# Altium project M-BOX.PrjPcb
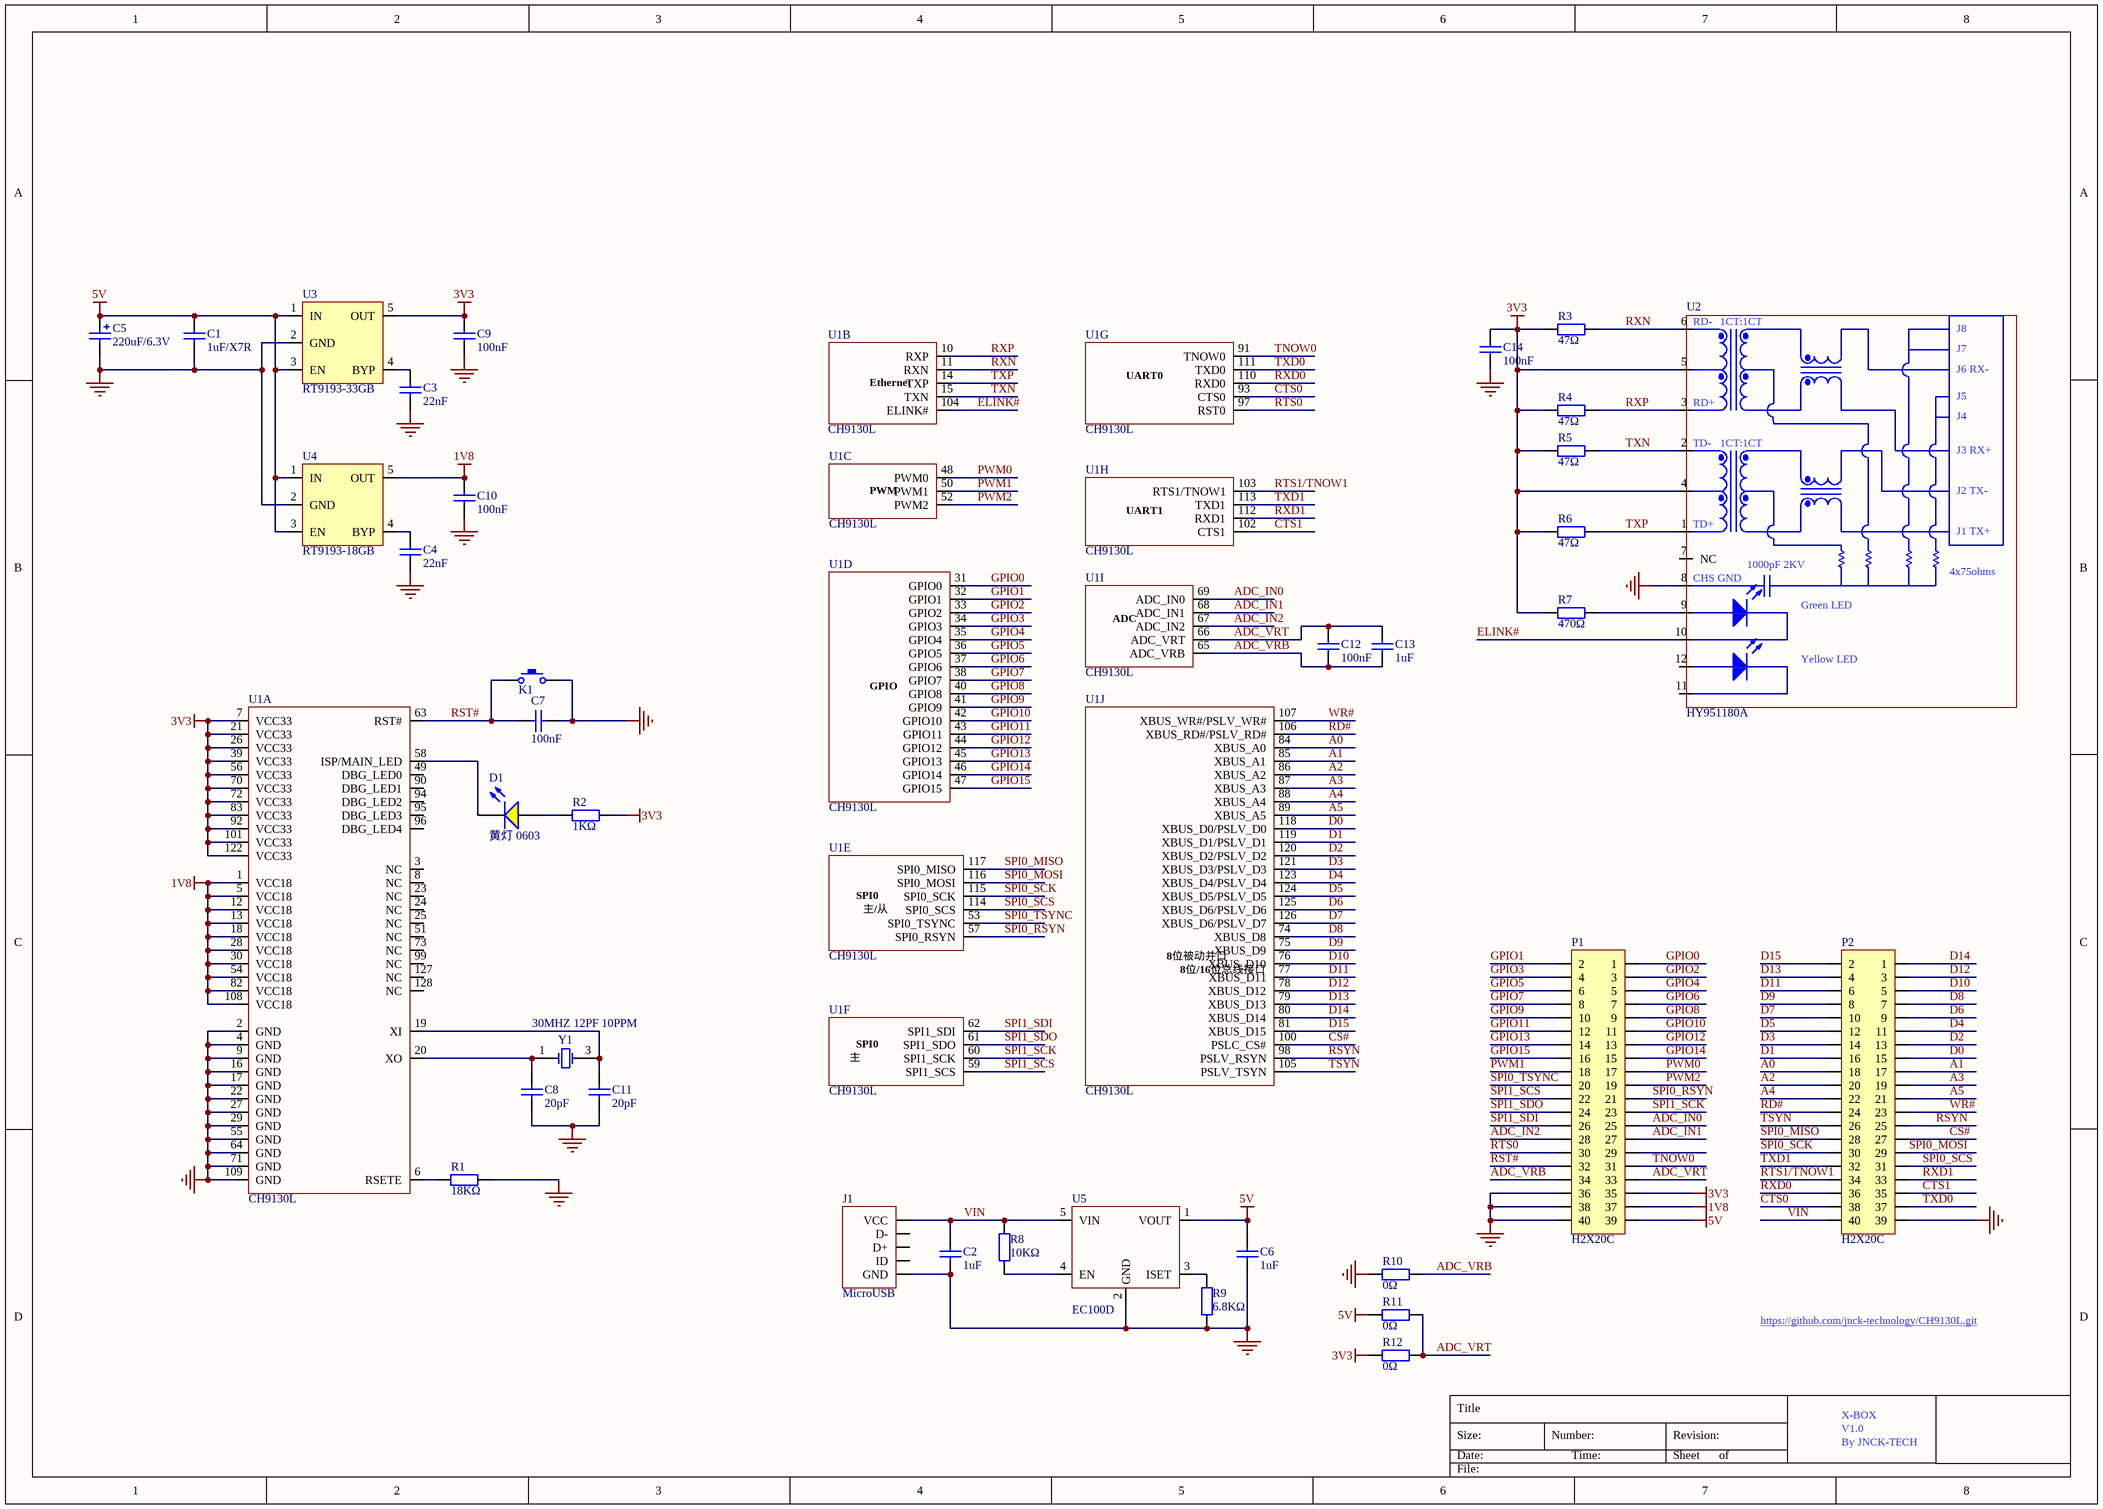
[diagram p0: M-BOX.SchDoc]
1 sheet, 37 parts. Net scope: global (net labels, ports and power ports of the same name join across sheets).
Board file: M-BOX.PcbDoc

## Sheet M-BOX.SchDoc
size A3; Organization: 无锡必创; Address1: 江苏省无锡市; Address2: 南长区; Address3: 飞宏路58号; Revision: V1.0; SheetNumber: G0909A01; ProjectName: 温湿度气压万年历

### Parts
C1  1uF/X7R  [LC-0603_C]
C2  1uF  [LC-0603_C]
C3  22nF  [LC-0603_C]
C4  22nF  [LC-0603_C]
C5  220uF/6.3V  [LC-CASE-A_3216]
C6  1uF  [LC-0603_C]
C7  100nF  [LC-0603_C]
C8  20pF  [LC-0603_C]
C9  100nF  [LC-0603_C]
C10  100nF  [LC-0603_C]
C11  20pF  [LC-0603_C]
C12  100nF  [LC-0603_C]
C13  1uF  [LC-0603_C]
C14  100nF  [LC-0603_C]
D1  黄灯 0603  [LC-0603_LED_S1]
J1  MicroUSB  [MicroUSB]
K1  TS-1107U  [TS-1107U]  (value not drawn)
P1  H2X20C  [H2X20C]
P2  H2X20C  [H2X20C]
R1  18KΩ  [LC-0603_R]
R2  1KΩ  [LC-0603_R]
R3  47Ω  [LC-0603_R]
R4  47Ω  [LC-0603_R]
R5  47Ω  [LC-0603_R]
R6  47Ω  [LC-0603_R]
R7  470Ω  [LC-0603_R]
R8  10KΩ  [LC-0603_R]
R9  6.8KΩ  [LC-0603_R]
R10  0Ω  [LC-0603_R]
R11  0Ω  [LC-0603_R]
R12  0Ω  [LC-0603_R]
U1  CH9130L  [LC-LQFP-128_14x14x04P]  (parts A,B,C,D,E,F,G,H,I,J of 10)
U2  HY951180A  [HY951180A]
U3  RT9193-33GB  [LC-SOT-23-5]
U4  RT9193-18GB  [LC-SOT-23-5]
U5  EC100D  [LC-SOT-23-5]
Y1  30MHZ 12PF 10PPM  [LC-SMD-3225_4P]

### Nets
1V8: C10.2 P1.37 U1.1(VCC18) U1.5(VCC18) U1.12(VCC18) U1.13(VCC18) U1.18(VCC18) U1.28(VCC18) U1.30(VCC18) U1.54(VCC18) U1.82(VCC18) U1.108(VCC18) U4.5(OUT)
3V3: C9.2 C14.2 P1.35 R2.2 R3.1 R4.1 R5.1 R6.1 R7.1 R12.1 U1.7(VCC33) U1.21(VCC33) U1.26(VCC33) U1.39(VCC33) U1.56(VCC33) U1.70(VCC33) U1.72(VCC33) U1.83(VCC33) U1.92(VCC33) U1.101(VCC33) U1.122(VCC33) U2.4 U2.5 U3.5(OUT)
5V: C1.2 C5.1 C6.2 P1.39 R11.1 U3.1(IN) U3.3(EN) U4.1(IN) U4.3(EN) U5.1(VOUT)
GND: C1.1 C2.1 C3.1 C4.1 C5.2 C6.1 C7.1 C8.1 C9.1 C10.1 C11.1 C14.1 J1.5(GND) K1.2 P1.36 P1.38 P1.40 P2.39 R1.2 R9.1 R10.1 U1.2(GND) U1.4(GND) U1.9(GND) U1.16(GND) U1.17(GND) U1.22(GND) U1.27(GND) U1.29(GND) U1.55(GND) U1.64(GND) U1.71(GND) U1.109(GND) U2.8(GND) U3.2(GND) U4.2(GND) U5.2(GND)
A0: P2.18 U1.84(XBUS_A0)
A1: P2.17 U1.85(XBUS_A1)
A2: P2.20 U1.86(XBUS_A2)
A3: P2.19 U1.87(XBUS_A3)
A4: P2.22 U1.88(XBUS_A4)
A5: P2.21 U1.89(XBUS_A5)
ADC_IN0: P1.25 U1.69(ADC_IN0)
ADC_IN1: P1.27 U1.68(ADC_IN1)
ADC_IN2: P1.28 U1.67(ADC_IN2)
ADC_VRB: C12.1 C13.1 P1.34 R10.2 U1.65(ADC_VRB)
ADC_VRT: C12.2 C13.2 P1.33 R11.2 R12.2 U1.66(ADC_VRT)
CS#: P2.27 U1.100(PSLC_CS#)
CTS0: P2.38 U1.93(CTS0)
CTS1: P2.35 U1.102(CTS1)
D0: P2.15 U1.118(XBUS_D0/PSLV_D0)
D1: P2.16 U1.119(XBUS_D1/PSLV_D1)
D2: P2.13 U1.120(XBUS_D2/PSLV_D2)
D3: P2.14 U1.121(XBUS_D3/PSLV_D3)
D4: P2.11 U1.123(XBUS_D4/PSLV_D4)
D5: P2.12 U1.124(XBUS_D5/PSLV_D5)
D6: P2.9 U1.125(XBUS_D6/PSLV_D6)
D7: P2.10 U1.126(XBUS_D6/PSLV_D7)
D8: P2.7 U1.74(XBUS_D8)
D9: P2.8 U1.75(XBUS_D9)
D10: P2.5 U1.76(XBUS_D10)
D11: P2.6 U1.77(XBUS_D11)
D12: P2.3 U1.78(XBUS_D12)
D13: P2.4 U1.79(XBUS_D13)
D14: P2.1 U1.80(XBUS_D14)
D15: P2.2 U1.81(XBUS_D15)
ELINK#: U1.104(ELINK#) U2.10
GPIO0: P1.1 U1.31(GPIO0)
GPIO1: P1.2 U1.32(GPIO1)
GPIO2: P1.3 U1.33(GPIO2)
GPIO3: P1.4 U1.34(GPIO3)
GPIO4: P1.5 U1.35(GPIO4)
GPIO5: P1.6 U1.36(GPIO5)
GPIO6: P1.7 U1.37(GPIO6)
GPIO7: P1.8 U1.38(GPIO7)
GPIO8: P1.9 U1.40(GPIO8)
GPIO9: P1.10 U1.41(GPIO9)
GPIO10: P1.11 U1.42(GPIO10)
GPIO11: P1.12 U1.43(GPIO11)
GPIO12: P1.13 U1.44(GPIO12)
GPIO13: P1.14 U1.45(GPIO13)
GPIO14: P1.15 U1.46(GPIO14)
GPIO15: P1.16 U1.47(GPIO15)
PWM0: P1.17 U1.48(PWM0)
PWM1: P1.18 U1.50(PWM1)
PWM2: P1.19 U1.52(PWM2)
RD#: P2.24 U1.106(XBUS_RD#/PSLV_RD#)
RST#: C7.2 K1.1 P1.32 U1.63(RST#)
RSYN: P2.25 U1.98(PSLV_RSYN)
RTS0: P1.30 U1.97(RST0)
RTS1/TNOW1: P2.34 U1.103(RTS1/TNOW1)
RXD0: P2.36 U1.110(RXD0)
RXD1: P2.33 U1.112(RXD1)
RXN: R3.2 U1.11(RXN) U2.6(RD-)
RXP: R4.2 U1.10(RXP) U2.3(RD+)
SPI0_MISO: P2.28 U1.117(SPI0_MISO)
SPI0_MOSI: P2.29 U1.116(SPI0_MOSI)
SPI0_RSYN: P1.21 U1.57(SPI0_RSYN)
SPI0_SCK: P2.30 U1.115(SPI0_SCK)
SPI0_SCS: P2.31 U1.114(SPI0_SCS)
SPI0_TSYNC: P1.20 U1.53(SPI0_TSYNC)
SPI1_SCK: P1.23 U1.60(SPI1_SCK)
SPI1_SCS: P1.22 U1.59(SPI1_SCS)
SPI1_SDI: P1.26 U1.62(SPI1_SDI)
SPI1_SDO: P1.24 U1.61(SPI1_SDO)
TNOW0: P1.31 U1.91(TNOW0)
TSYN: P2.26 U1.105(PSLV_TSYN)
TXD0: P2.37 U1.111(TXD0)
TXD1: P2.32 U1.113(TXD1)
TXN: R5.2 U1.15(TXN) U2.2(TD-)
TXP: R6.2 U1.14(TXP) U2.1(TD+)
VIN: C2.2 J1.1(VCC) P2.40 R8.2 U5.5(VIN)
WR#: P2.23 U1.107(XBUS_WR#/PSLV_WR#)
NetC3_2: C3.2 U3.4(BYP)
NetC4_2: C4.2 U4.4(BYP)
NetC8_2: C8.2 U1.20(XO) Y1.1(OSC1)
NetC11_2: C11.2 U1.19(XI) Y1.3(OSC2)
NetD1_A: D1.A R2.1
NetD1_K: D1.K U1.58(ISP/MAIN_LED)
NetR1_1: R1.1 U1.6(RSETE)
NetR7_2: R7.2 U2.9
NetR8_1: R8.1 U5.4(EN)
NetR9_2: R9.2 U5.3(ISET)

Not connected (* = marked no-connect by the designer): J1 2(D-) 3(D+) 4(ID); P1 29; U1 3(NC) 8(NC) 23(NC) 24(NC) 25(NC) 49(DBG_LED0) 51(NC) 73(NC) 90(DBG_LED1) 94(DBG_LED2) 95(DBG_LED3) 96(DBG_LED4) 99(NC) 127(NC) 128(NC); U2 7(NC) 11 12

### Notes on the sheet
- https://github.com/jnck-technology/CH9130L.git
- X-BOX
- V1.0
- By JNCK-TECH
- Title
- Size:
- Date:
- Number:
- Time:
- Revision:
- Sheet
- of
- File:
- (in symbol CH9130L, part B) Ethernet
- (in symbol CH9130L, part C) PWM
- (in symbol CH9130L, part D) GPIO
- (in symbol CH9130L, part E) SPI0; 主/从
- (in symbol CH9130L, part F) SPI0; 主
- (in symbol CH9130L, part G) UART0
- (in symbol CH9130L, part H) UART1
- (in symbol CH9130L, part I) ADC
- (in symbol CH9130L, part J) 8位被动并口; 8位/16位总线接口
- (in symbol HY951180A) 1CT:1CT; J8; J7; J6 RX-; J5; J4; J3 RX+; J2 TX-; J1 TX+; 1000pF 2KV; 4x75ohms; CHS GND; Green LED; Yellow LED

### Library data of the parts
C1 C2 C6 C13 = 0603 1uF (105) 10% 50V: 贴片电容; ComponentLink1Description: 供应商链接; Package: 0603; Supplier: LC
  C1: ComponentLink1URL: http://www.szlcsc.com/product/details_30690.html; SuppliersPartNumber: C29936
  C2 C6 C13: ComponentLink1URL: http://www.szlcsc.com/product/details_16531.html; SuppliersPartNumber: C15849
C3 C4 = 0603 22nF (223) 10% 50V: 贴片电容; ComponentLink1Description: 供应商链接; ComponentLink1URL: http://www.szlcsc.com/product/details_21834.html; Package: 0603; Supplier: LC; SuppliersPartNumber: C21122
C5 = 3216 10uF (106) 10% 16V: 钽电容; ComponentLink1Description: 供应商链接; ComponentLink1URL: http://www.szlcsc.com/product/details_28028.html; Package: 3216; Supplier: LC; SuppliersPartNumber: C27279
C7 C9 C10 C12 C14 = 0603 100nF (104) 10% 50V: 贴片电容; ComponentLink1Description: 供应商链接; ComponentLink1URL: http://www.szlcsc.com/product/details_15331.html; Package: 0603; Supplier: LC; SuppliersPartNumber: C14663
C8 C11 = 0603 20pF (200) 5% 50V: 贴片电容; ComponentLink1Description: 供应商链接; ComponentLink1URL: http://www.szlcsc.com/product/details_2000.html; Package: 0603; Supplier: LC; SuppliersPartNumber: C1648
D1 = 0603 黄灯: 发光二极管; ComponentLink1Description: 供应商链接; ComponentLink1URL: http://www.szlcsc.com/product/details_73147.html; Package: 0603; Supplier: LC; SuppliersPartNumber: C72038
K1 = SW_TS-1107U: 轻触按钮; Manufacturer: 皓宇電子; Manufacturer No: TS-1107U
P1 P2 = H2X20C: 排母/2.54mm 2*20P 长脚排座; ComponentLink1Description: 供应商链接; ComponentLink1URL: http://www.szlcsc.com/product/details_36136.html; Supplier: LC; SuppliersPartNumber: C35165
R1 = 0603 18KΩ (1802) 1%: 贴片电阻; ComponentLink1Description: 供应商链接; ComponentLink1URL: http://www.szlcsc.com/product/details_26553.html; Package: 0603; Supplier: LC; SuppliersPartNumber: C25810
R2 = 0603 1KΩ (1001) 1%: 贴片电阻; ComponentLink1Description: 供应商链接; ComponentLink1URL: http://www.szlcsc.com/product/details_21904.html; Package: 0603; Supplier: LC; SuppliersPartNumber: C21190
R3-R6 = 0603 47Ω (47R0) 1%: 贴片电阻; ComponentLink1Description: 供应商链接; ComponentLink1URL: http://www.szlcsc.com/product/details_23909.html; Package: 0603; Supplier: LC; SuppliersPartNumber: C23182
R7 = 0603 470Ω (4700) 1%: 贴片电阻; ComponentLink1Description: 供应商链接; ComponentLink1URL: http://www.szlcsc.com/product/details_23906.html; Package: 0603; Supplier: LC; SuppliersPartNumber: C23179
R8 = 0603 10KΩ (1002) 1%: 贴片电阻; ComponentLink1Description: 供应商链接; ComponentLink1URL: http://www.szlcsc.com/product/details_26547.html; Package: 0603; Supplier: LC; SuppliersPartNumber: C25804
R9 = 0603 6.8KΩ (6801) 1%: 贴片电阻; ComponentLink1Description: 供应商链接; ComponentLink1URL: http://www.szlcsc.com/product/details_23939.html; Package: 0603; Supplier: LC; SuppliersPartNumber: C23212
R10-R12 = 0603 0Ω (0R0) 1%: 贴片电阻; ComponentLink1Description: 供应商链接; ComponentLink1URL: http://www.szlcsc.com/product/details_21903.html; Package: 0603; Supplier: LC; SuppliersPartNumber: C21189
U1 = CH9130L: 以太网扩展多外设接口芯片; Manufacturer: WCH(南京沁恒); JLC No: C97380; Manufacturer No: CH9130L; Value: *
U2 = HY951180A: 网口; Manufacturer: HANRUN(汉仁); JLC No: C34677; Manufacturer No: HY951180A; Value: *
U3 = RT9193-33GB: RT9193 Series 300 mA 3.3 V; ComponentLink1Description: 供应商链接; ComponentLink1URL: http://www.szlcsc.com/product/details_16332.html; Package: SOT-23-5; Supplier: LC; SuppliersPartNumber: C15651
U4 = RT9193-18GB: RT9193 Series 1.8V 300 mA; ComponentLink1Description: 供应商链接; ComponentLink1URL: http://www.szlcsc.com/product/details_28165.html; Package: SOT-23-5; Supplier: LC; SuppliersPartNumber: C27416
U5 = EC100D: 短路、过流保护芯片; Manufacturer: FM富满; ComponentLink1Description: 供应商链接; ComponentLink1URL: http://www.szlcsc.com/product/details_88577.html; Package: SOT-23-5; Supplier: LC; SuppliersPartNumber: C87399
Y1 = SMD-3225_4P  16MHZ 9PF 10PPM: 贴片晶振; ComponentLink1Description: 供应商链接; ComponentLink1URL: http://www.szlcsc.com/product/details_71690.html; Package: SMD-3225_4P; Supplier: LC; SuppliersPartNumber: C70592
J1 = MicroUSB: Purchase: http://www.szlcsc.com/product/details_22094.html; JLC No: C21377; Manufacturer No: MicroUSB; Value: *